# EAGLE design LED and Push button to ATMega32 (EAGLE 9.6.0)
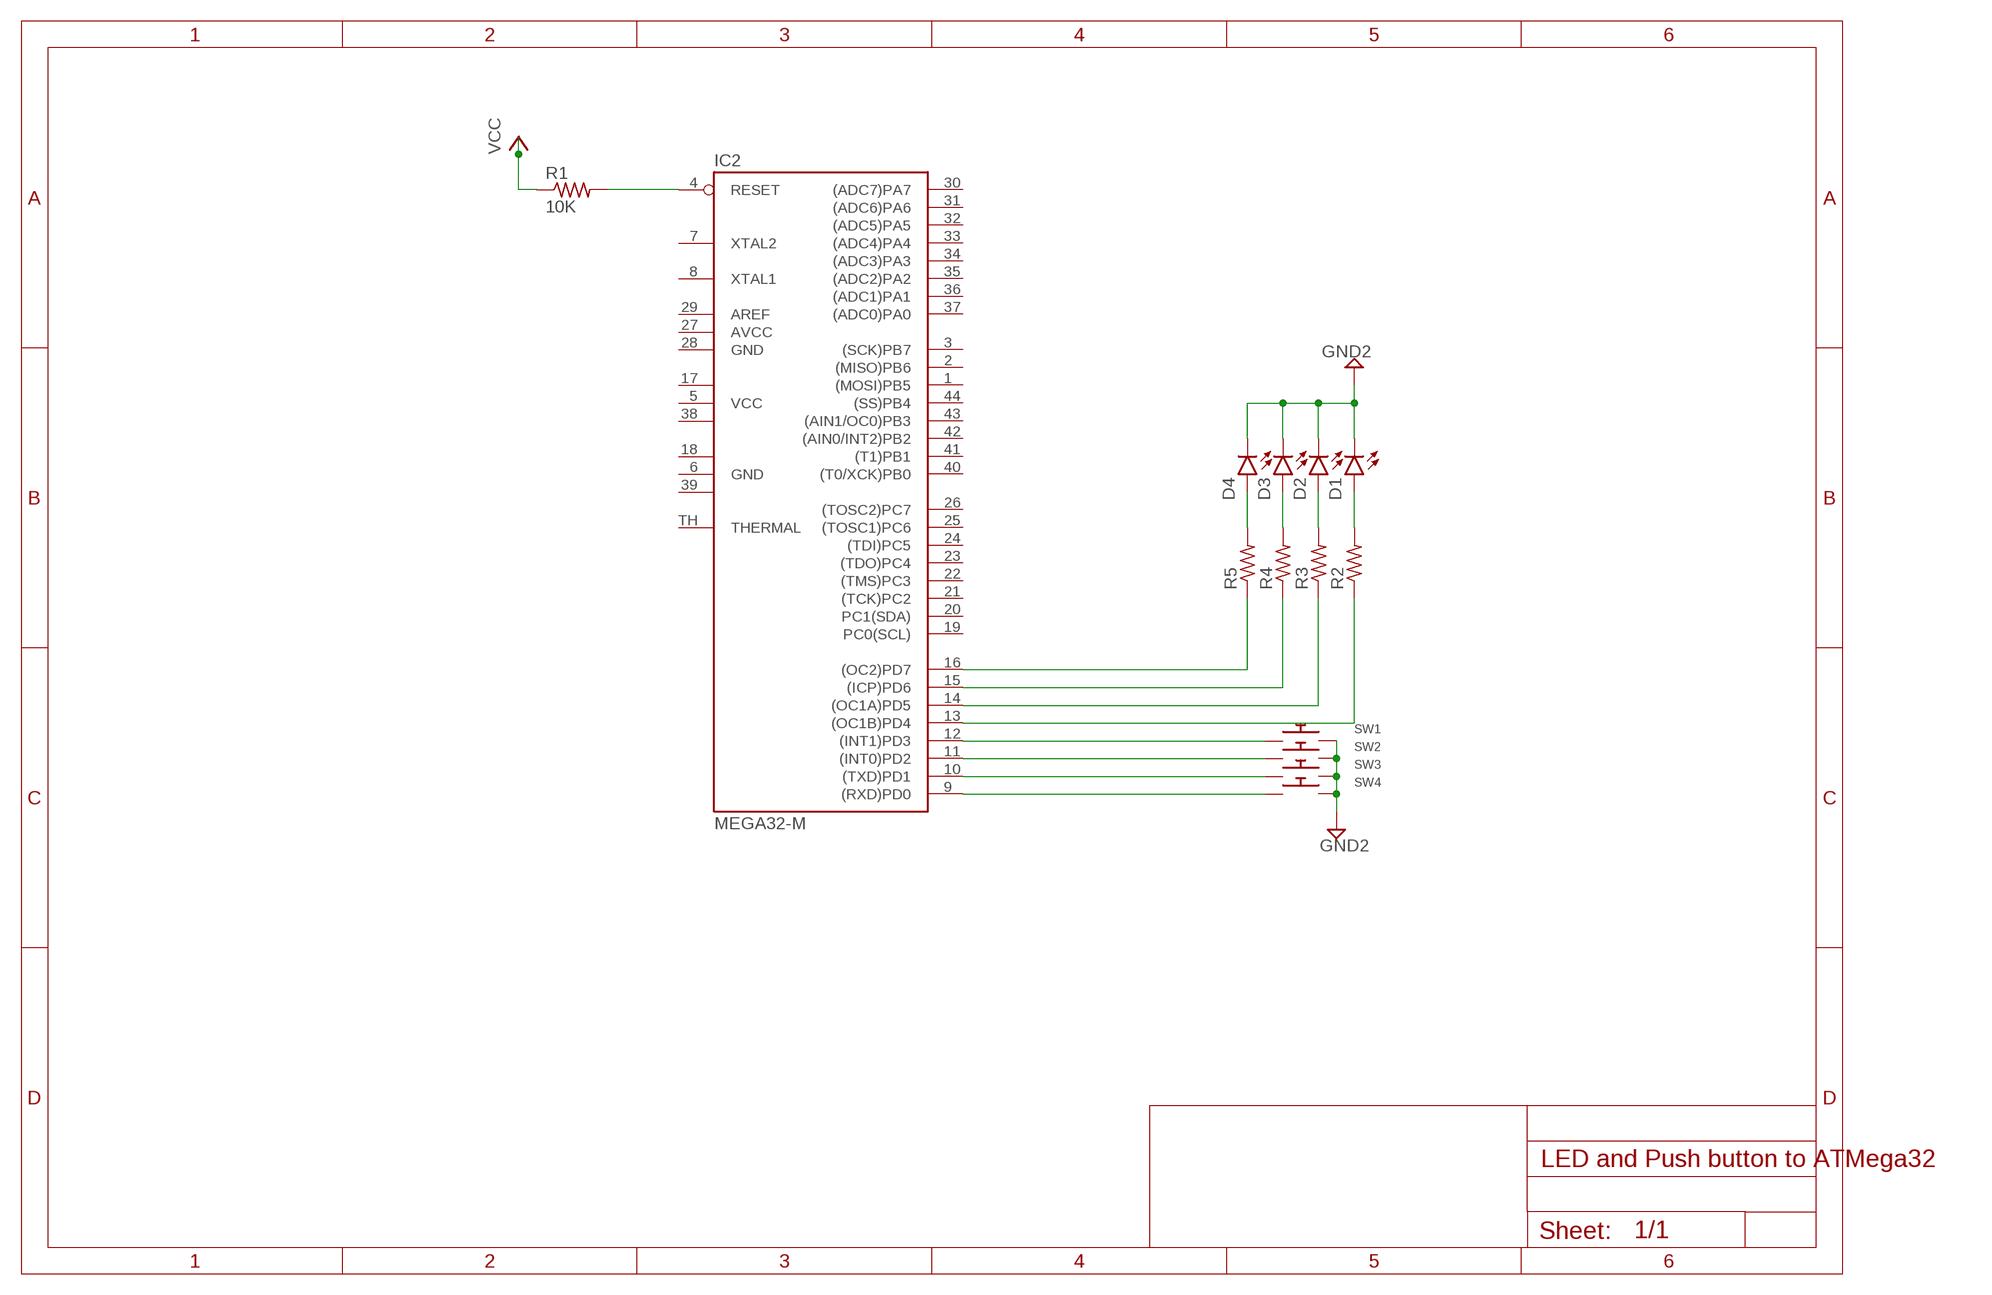
[diagram p0: schematic, sheet 1]

## Parts
D1  LEDCHIPLED_0805  [CHIPLED_0805]
D2  LEDCHIPLED_0805  [CHIPLED_0805]
D3  LEDCHIPLED_0805  [CHIPLED_0805]
D4  LEDCHIPLED_0805  [CHIPLED_0805]
IC2  MEGA32-M  [MLF44-TH]
R1  10K  R-US_R0805  [R0805]
R2  330R  R-US_R0805  [R0805]
R3  330R  R-US_R0805  [R0805]
R4  330R  R-US_R0805  [R0805]
R5  330R  R-US_R0805  [R0805]
SW1  SWITCH_PUSHBUTTONC&K_KSS  [BTN_CK_KSS]
SW2  SWITCH_PUSHBUTTONC&K_KSS  [BTN_CK_KSS]
SW3  SWITCH_PUSHBUTTONC&K_KSS  [BTN_CK_KSS]
SW4  SWITCH_PUSHBUTTONC&K_KSS  [BTN_CK_KSS]

## Nets
GND2: D1.C D2.C D3.C D4.C SW1.P$2 SW2.P$2 SW3.P$2 SW4.P$2
N$1: IC2.9((RXD)PD0) SW4.P$1
N$2: IC2.10((TXD)PD1) SW3.P$1
N$3: IC2.11((INT0)PD2) SW2.P$1
N$4: IC2.12((INT1)PD3) SW1.P$1
N$5: IC2.13((OC1B)PD4) R2.1
N$6: IC2.14((OC1A)PD5) R3.1
N$7: IC2.15((ICP)PD6) R4.1
N$8: IC2.16((OC2)PD7) R5.1
N$9: D4.A R5.2
N$10: D3.A R4.2
N$11: D2.A R3.2
N$12: D1.A R2.2
N$14: IC2.4(RESET) R1.2
VCC: R1.1
Unconnected: IC2.1((MOSI)PB5) IC2.2((MISO)PB6) IC2.3((SCK)PB7) IC2.7(XTAL2) IC2.8(XTAL1) IC2.19(PC0(SCL)) IC2.20(PC1(SDA)) IC2.21((TCK)PC2) IC2.22((TMS)PC3) IC2.23((TDO)PC4) IC2.24((TDI)PC5) IC2.25((TOSC1)PC6) IC2.26((TOSC2)PC7) IC2.29(AREF) IC2.30((ADC7)PA7) IC2.31((ADC6)PA6) IC2.32((ADC5)PA5) IC2.33((ADC4)PA4) IC2.34((ADC3)PA3) IC2.35((ADC2)PA2) IC2.36((ADC1)PA1) IC2.37((ADC0)PA0) IC2.40((T0/XCK)PB0) IC2.41((T1)PB1) IC2.42((AIN0/INT2)PB2) IC2.43((AIN1/OC0)PB3) IC2.44((SS)PB4) IC2.TH(THERMAL)

## Power pins joined to a net without a drawn wire
AVCC: IC2.27(AVCC)
GND: IC2.6(GND) IC2.28(GND)
GND1: IC2.18(GND1)
GND2: IC2.39(GND2)
VCC: IC2.5(VCC)
VCC1: IC2.17(VCC1)
VCC2: IC2.38(VCC2)

## Library data of the parts
D1-D4 = led:LED: LED OSRAM: - CHIPLED LG R971, LG N971, LY N971, LG Q971, LY Q971, LO R971, LY R971 LH N974, LH R974 LS Q976, LO Q976, LY Q976 LO Q996 - Hyper CHIPLED LW Q18S LB Q993, LB Q99A, LB R99A - SideLED LS A670, LO A670, LY A670, LG A670, LP A670 LB A673, LV A673, LT A673, LW A673 LH A674 LY A675 LS A676, LA A676, LO A676, LY A676, LW A676 LS A679, LY A679, LG A679 - Hyper Micro SIDELED® LS Y876, LA Y876, LO Y876, LY Y876 LT Y87S - SmartLED LW L88C, LW L88S LB L89C, LB L89S, LG L890 LS L89K, LO L89K, LY L89K LS L896, LA L896, LO L896, LY L896 - TOPLED LS T670, LO T670, LY T670, LG T670, LP T670 LSG T670, LSP T670, LSY T670, LOP T670, LYG T670 LG T671, LOG T671, LSG T671 LB T673, LV T673, LT T673, LW T673 LH T674 LS T676, LA T676, LO T676, LY T676, LB T676, LH T676, LSB T676, LW T676 LB T67C, LV T67C, LT T67C, LS T67K, LO T67K, LY T67K, LW E67C LS E67B, LA E67B, LO E67B, LY E67B, LB E67C, LV E67C, LT E67C LW T67C LS T679, LY T679, LG T679 LS T770, LO T770, LY T770, LG T770, LP T770 LB T773, LV T773, LT T773, LW T773 LH T774 LS E675, LA E675, LY E675, LS T675 LS T776, LA T776, LO T776, LY T776, LB T776 LHGB T686 LT T68C, LB T68C - Hyper Mini TOPLED® LB M676 - Mini TOPLED Santana® LG M470 LS M47K, LO M47K, LY M47K Source: http://www.osram.convergy.de LUXEON: - LUMILED® LXK2-PW12-R00, LXK2-PW12-S00, LXK2-PW14-U00, LXK2-PW14-V00 LXK2-PM12-R00, LXK2-PM12-S00, LXK2-PM14-U00 LXK2-PE12-Q00, LXK2-PE12-R00, LXK2-PE12-S00, LXK2-PE14-T00, LXK2-PE14-U00 LXK2-PB12-K00, LXK2-PB12-L00, LXK2-PB12-M00, LXK2-PB14-N00, LXK2-PB14-P00, LXK2-PB14-Q00 LXK2-PR12-L00, LXK2-PR12-M00, LXK2-PR14-Q00, LXK2-PR14-R00 LXK2-PD12-Q00, LXK2-PD12-R00, LXK2-PD12-S00 LXK2-PH12-R00, LXK2-PH12-S00 LXK2-PL12-P00, LXK2-PL12-Q00, LXK2-PL12-R00 Source: www.luxeon.com KINGBRIGHT: KA-3528ASYC Source: www.kingbright.com
IC2 = atmel:MEGA32-M: MICROCONTROLLER 32 Kbytes FLASH 2 Kbytes SRAM 1 Kbytes EEPROM USART 8-channel 10 bit ADC Source: www.atmel.com .. doc2503.pdf; MPN: ATMEGA32-16MU; OC_FARNELL: 1455108; OC_NEWARK: 58M3733
R1-R5 = rcl:R-US_: RESISTOR, American symbol; SPICEPREFIX: R
SW1-SW4 = adafruit:SWITCH_PUSHBUTTON: Buttons SOFTTOUCHSMD_SJ - Soft touch temporary push button (Super Junk Akihabara) Compatible with SKPMANE010 [Mouser: 688-SKPMAN] C&K_KSS = Digikey: KSS221GLFS

## Board
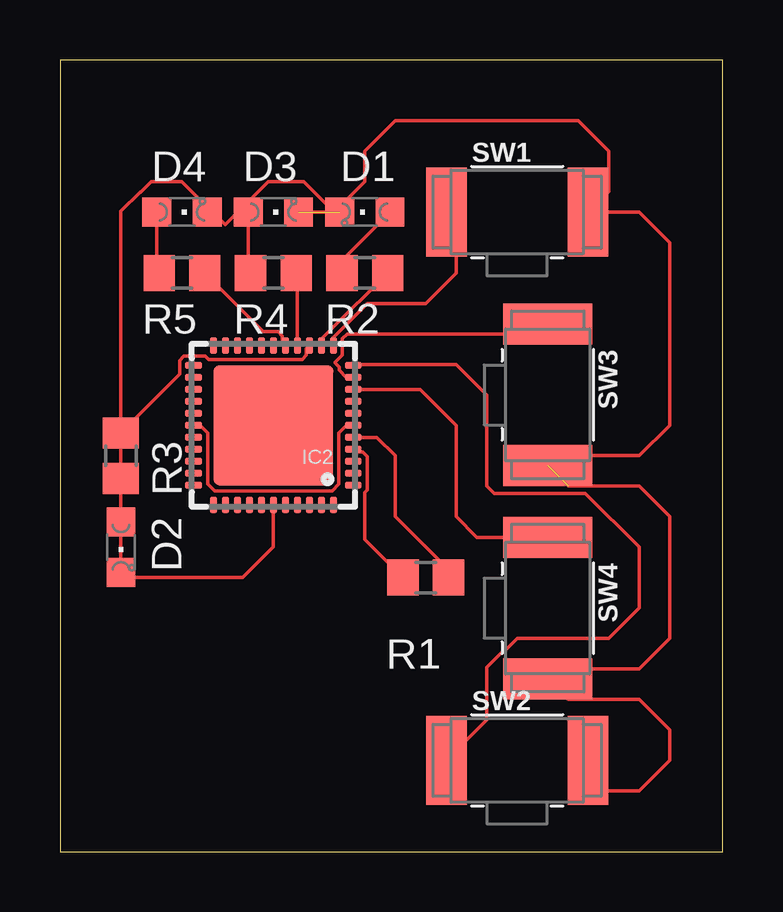
[diagram p1: board, top side]

Size 27.61 x 33.01 mm. Coordinates in mm from the lower left corner, seen from the top.
Outline: 0,0 27.61,0 27.61,33.01 0,33.01 0,0
Copper layers (1*16): Top 0.035mm / dielectric 1.5mm / Bottom 0.035mm
Design rules "default": minimum track width 6mil, minimum drill 0.35mm, track to track 6mil, track to pad 6mil, pad to pad 6mil, via to via 6mil, smd to smd 6mil, copper to edge 40mil, drill to drill 6mil, minimum pad ring 10mil, minimum via ring 8mil, stop-mask expansion 4mil, vias tented up to drill 0mil, thermal gap 10mil

### Footprints (pad centres in the part's own frame; a part is rotated, then mirrored left to right if it is on the bottom)
CHIPLED_0805 = smd 1.2 x 1.2: A 0,-1.05; C 0,1.05
MLF44-TH = smd 0.7 x 0.3: 1 -3.325,2.5; 2 -3.325,2; 3 -3.325,1.5; 4 -3.325,1; 5 -3.325,0.5; 6 -3.325,0; 7 -3.325,-0.5; 8 -3.325,-1; 9 -3.325,-1.5; 10 -3.325,-2; 11 -3.325,-2.5; 23 3.325,-2.5; 24 3.325,-2; 25 3.325,-1.5; 26 3.325,-1; 27 3.325,-0.5; 28 3.325,0; 29 3.325,0.5; 30 3.325,1; 31 3.325,1.5; 32 3.325,2; 33 3.325,2.5 | smd 0.3 x 0.7: 12 -2.5,-3.325; 13 -2,-3.325; 14 -1.5,-3.325; 15 -1,-3.325; 16 -0.5,-3.325; 17 0,-3.325; 18 0.5,-3.325; 19 1,-3.325; 20 1.5,-3.325; 21 2,-3.325; 22 2.5,-3.325; 34 2.5,3.325; 35 2,3.325; 36 1.5,3.325; 37 1,3.325; 38 0.5,3.325; 39 0,3.325; 40 -0.5,3.325; 41 -1,3.325; 42 -1.5,3.325; 43 -2,3.325; 44 -2.5,3.325 | smd 5 x 5: TH 0,0
R0805 = smd 1.3 x 1.5: 1 -0.95,0; 2 0.95,0
BTN_CK_KSS = smd 1.7 x 3.7: P$1 -2.95,0; P$2 2.95,0

### Placement (x,y rotation side)
D1  12.7,26.67 90 top
D2  2.54,12.7 180 top
D3  8.89,26.67 270 top
D4  5.08,26.67 270 top
IC2  8.89,17.78 180 top
R1  15.24,11.43 180 top
R2  12.7,24.13 180 top
R3  2.54,16.51 270 top
R4  8.89,24.13 180 top
R5  5.08,24.13 180 top
SW1  19.05,26.67 0 top
SW2  19.05,3.81 0 top
SW3  20.32,19.05 270 top
SW4  20.32,10.16 270 top

### Tracks (layer width: path | path; a pad name or v marks a point on that pad's centre or on a via)
GND
  Top 0.152: IC2.6 11.94,17.78 11.62,17.46 11.62,15.33 11.34,15.05 6.44,15.05 6.16,15.33 6.16,17.46 5.84,17.78 IC2.28
GND2  (2 unrouted)
  Top 0.152: D1.C 11.43,26.67 10.16,27.94 8.67,27.94 6.88,26.14 6.24,26.78 | 6.24,26.78 D4.C | D3.C D1.C | 6.24,26.78 5.08,27.94 3.81,27.94 3.37,27.5 3.33,27.5 2.54,26.7 D2.C 2.76,11.43 7.62,11.43 8.89,12.7 IC2.39 | D1.C 11.65,26.89 12.7,27.94 12.7,29.21 13.97,30.48 21.59,30.48 22.86,29.21 22.86,27.53 SW1.P$2 24.13,26.67 25.4,25.4 25.4,17.78 24.13,16.51 20.32,16.51 SW3.P$2 | 21.18,15.24 24.13,15.24 25.4,13.97 25.4,8.89 24.13,7.62 20.32,7.62 SW4.P$2 21.18,6.35 24.13,6.35 25.4,5.08 25.4,3.81 24.13,2.54 21.59,2.54 21.59,3.4 SW2.P$2
N$1
  Top 0.152: SW4.P$1 17.37,13.11 16.51,13.97 16.51,17.78 15.01,19.28 IC2.9
N$2
  Top 0.152: SW3.P$1 19.91,21.59 11.97,21.59 11.77,21.39 11.77,20.7 11.48,20.41 11.48,20.37 11.64,20.21 11.64,20.08 11.94,19.78 IC2.10
N$3
  Top 0.152: SW2.P$1 17.78,5.49 17.78,7.69 18.38,8.29 18.45,8.29 19.05,8.89 22.86,8.89 24.13,10.16 24.13,12.7 21.89,14.94 18.09,14.94 17.78,15.24 17.78,19.05 16.51,20.32 12.26,20.32 IC2.11
N$4
  Top 0.152: SW1.P$1 16.51,26.26 16.51,24.13 15.24,22.86 12.81,22.86 11.39,21.44 IC2.12
N$5
  Top 0.152: R2.1 11.2,21.68 11.19,21.68 10.89,21.38 IC2.13
N$6
  Top 0.152: R3.1 4.99,19.91 4.99,20.48 5.16,20.66 6.06,20.66 6.19,20.53 10.09,20.53 10.27,20.7 10.27,20.98 IC2.14
N$7
  Top 0.152: IC2.15 9.89,24.08 R4.1
N$8
  Top 0.152: R5.1 8.48,21.68 9.09,21.68 9.27,21.51 9.27,21.23 IC2.16
N$9
  Top 0.152: D4.A 4.03,24.23 R5.2
N$10
  Top 0.152: D3.A 7.84,24.23 R4.2
N$11
  Top 0.152: D2.A R3.2
N$12
  Top 0.152: D1.A 11.75,24.67 R2.2
N$14
  Top 0.152: R1.2 12.7,13.02 12.7,14.99 12.79,15.08 12.79,16.48 12.62,16.66 12.34,16.66 IC2.4
VCC
  Top 0.152: 16.51,11.75 R1.1 16.19,11.75 13.97,13.97 13.97,16.51 13.2,17.28 IC2.5